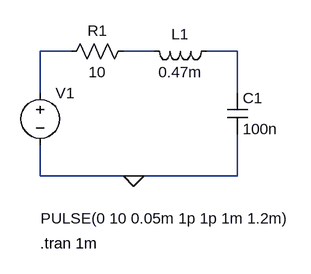
[diagram p0: schematic lab_2.asc]
lab_2.asc, the LTspice schematic file:
Version 4
SHEET 1 880 680
WIRE 128 64 80 64
WIRE 256 64 208 64
WIRE 384 64 336 64
WIRE 80 128 80 64
WIRE 384 128 384 64
WIRE 80 256 80 208
WIRE 224 256 80 256
WIRE 384 256 384 192
WIRE 384 256 224 256
FLAG 224 256 0
SYMBOL voltage 80 112 R0
WINDOW 3 1 209 Left 2
WINDOW 123 0 0 Left 0
WINDOW 39 0 0 Left 0
SYMATTR Value PULSE(0 10 0.05m 1p 1p 1m 1.2m)
SYMATTR InstName V1
SYMBOL res 224 48 R90
WINDOW 0 0 56 VBottom 2
WINDOW 3 32 56 VTop 2
SYMATTR InstName R1
SYMATTR Value 10
SYMBOL ind 352 48 R90
WINDOW 0 5 56 VBottom 2
WINDOW 3 32 56 VTop 2
SYMATTR InstName L1
SYMATTR Value 0.47m
SYMATTR SpiceLine Rser=1.1
SYMBOL cap 368 128 R0
SYMATTR InstName C1
SYMATTR Value 100n
TEXT 80 360 Left 2 !.tran 1m

The netlist it stands for:
* lab_2.asc
V1 N001 0 PULSE(0 10 0.05m 1p 1p 1m 1.2m)
R1 N002 N001 10
L1 N003 N002 0.47m Rser=1.1
C1 N003 0 100n
.tran 1m
.backanno
.end